# EAGLE schematic PCB 1b (EAGLE 9.0.1)
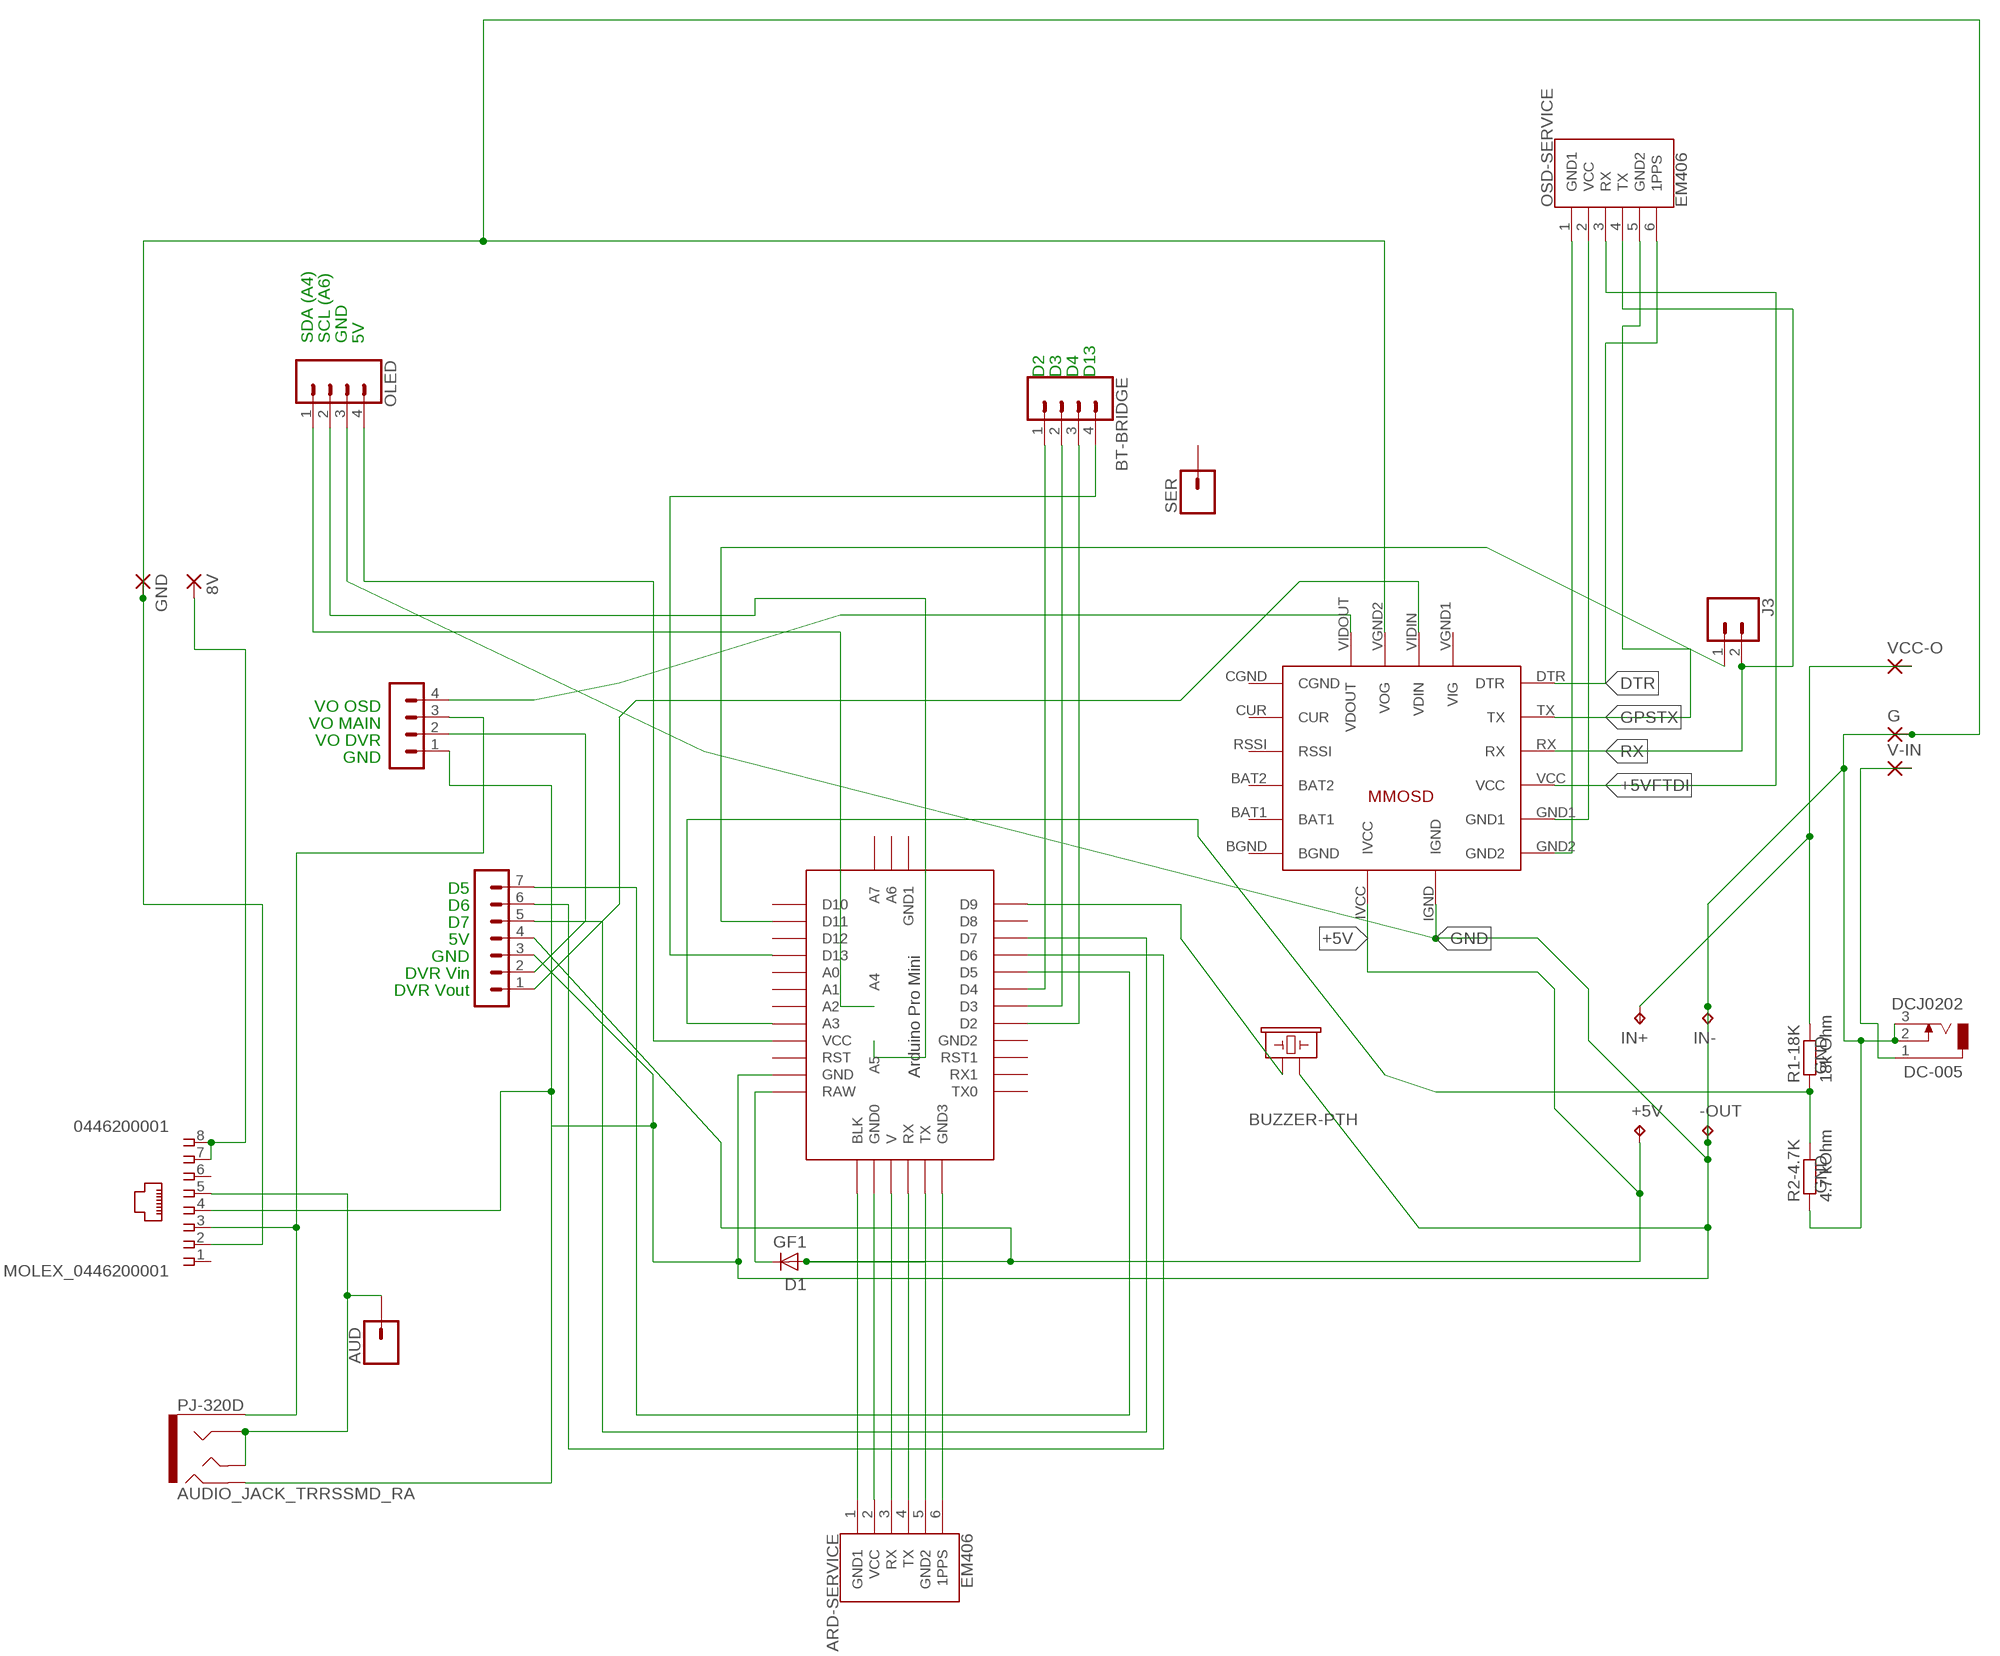
[diagram p0: schematic, sheet 1]

## Parts
8V  2,54/1,1  [2,54/1,1]
+5V  TPTP20SQ  [TP20SQ]
-OUT  TPTP20SQ  [TP20SQ]
ARD-SERVICE  EM406  [1X06-1MM]
AUD  CONN_01  [1X01]
BT-BRIDGE  CONN_04  [1X04]
BUZZ  BUZZER-PTH  [BUZZER-12MM]
D1  GF1  [SMA-DO214AC]
DC-005  DCJ0202  [DCJ0202]
DVR/MODULE-IO  MA07-1  [MA07-1]
G  2,54/1,1  [2,54/1,1]
GND  2,54/1,1  [2,54/1,1]
IN+  TPTP20SQ  [TP20SQ]
IN-  TPTP20SQ  [TP20SQ]
J3  CONN_02  [1X02]
MINIMOSD  MICROMINIMOSDPWR  [MMOSDNVDVID]
MOLEX_0446200001  0446200001  [0446200001]
OLED  CONN_04  [1X04]
OSD-SERVICE  EM406  [1X06-1MM]
PJ-320D  AUDIO_JACK_TRRSSMD_RA  [AUDIO_JACK_3.5MM_TRRS_SMD_RA]
R1-18K  18k Ohm  R-EU_M1206  [M1206]
R2-4.7K  4.7 kOhm  R-EU_M1206  [M1206]
SER  CONN_01  [1X01]
U$1  ABK-PRO-MINI  [ABK-PRO-MINI]
V-IN  2,54/1,1  [2,54/1,1]
V-IO  MA04-1  [MA04-1]
VCC-O  2,54/1,1  [2,54/1,1]

## Nets
8V: 8V.1(P) MOLEX_0446200001.7 MOLEX_0446200001.8
+: DC-005.1 V-IN.1(P)
+5V: +5V.TP D1.A DVR/MODULE-IO.4 MINIMOSD.IVCC
+5VFTDI [thin]: MINIMOSD.VCC OSD-SERVICE.3(RX)
AUDIO [medium]: AUD.1 MOLEX_0446200001.5 PJ-320D.RING1 PJ-320D.TIP
D5 [thin]: DVR/MODULE-IO.7 U$1.D5
D6 [thin]: DVR/MODULE-IO.6 U$1.D6
D7 [thin]: DVR/MODULE-IO.5 U$1.D7
D10RX [thin]: J3.1 U$1.D11
DTR [thin]: MINIMOSD.DTR OSD-SERVICE.6(1PPS)
DVRVIDEO-IN [medium]: DVR/MODULE-IO.2 V-IO.2
GND [d_cl]: -OUT.TP BUZZ.- DC-005.2 DC-005.3 DVR/MODULE-IO.3 G.1(P) GND.1(P) IN-.TP MINIMOSD.IGND MINIMOSD.VGND2(VOG) MOLEX_0446200001.2 MOLEX_0446200001.4 OLED.3 PJ-320D.RING2 R2-4.7K.1 U$1.GND V-IO.1
GPSTX [thin]: MINIMOSD.TX OSD-SERVICE.5(GND2)
HP5 [thin]: BT-BRIDGE.3 U$1.D2
HP6 [thin]: BT-BRIDGE.1 U$1.D4
N$1 [thin]: BT-BRIDGE.2 U$1.D3
N$2: OLED.4 U$1.VCC
N$3 [d_cl]: MINIMOSD.GND1 OSD-SERVICE.2(VCC)
N$4: D1.K(C) U$1.RAW
N$5: MINIMOSD.GND2 OSD-SERVICE.1(GND1)
N$7 [thin]: BT-BRIDGE.4 U$1.D13
N$10 [thin]: BUZZ.+ U$1.D9
N$12: R1-18K.1 R2-4.7K.2 U$1.A0(A3)
N$16 [thin]: ARD-SERVICE.1(GND1) U$1.BLK
N$18 [thin]: ARD-SERVICE.2(VCC) U$1.G(GND0)
N$19 [thin]: ARD-SERVICE.3(RX) U$1.5V(V)
N$21 [thin]: ARD-SERVICE.5(GND2) U$1.TX01(TX)
N$22 [thin]: ARD-SERVICE.6(1PPS) U$1.DTR(GND3)
OSDSIGNAL [medium]: MINIMOSD.VIDOUT(VDOUT) V-IO.4
RAWVIDEO_MODULE [medium]: DVR/MODULE-IO.1 MINIMOSD.VIDIN(VDIN)
RX [thin]: J3.2 MINIMOSD.RX OSD-SERVICE.4(TX)
SCL [thin]: OLED.2 U$1.A5
SDA [thin]: OLED.1 U$1.A4
V [thin]: ARD-SERVICE.4(TX) U$1.RX01(RX)
VCC: IN+.TP R1-18K.2 VCC-O.1(P)
VMAIN [medium]: MOLEX_0446200001.3 PJ-320D.EARTH V-IO.3
Unconnected: MINIMOSD.CUR MINIMOSD.RSSI MINIMOSD.VGND1(VIG) MOLEX_0446200001.1 MOLEX_0446200001.6 SER.1 U$1.A1(A2) U$1.A2(A1) U$1.A3(A0) U$1.A6 U$1.A7 U$1.D8 U$1.D10 U$1.D12 U$1.GND1(GND2) U$1.GND4(GND1) U$1.RST U$1.RST1 U$1.RX1 U$1.TX0

## Notes on the sheet
- SDA (A4) | SCL (A6) | GND | 5V
- D2 | D3 | D4 | D13
- VO OSD
- VO MAIN
- VO DVR
- GND
- D5
- D6
- D7
- 5V
- GND
- DVR Vin
- DVR Vout

## Power pins joined to a net without a drawn wire
BAT1: MINIMOSD.BAT1
BAT2: MINIMOSD.BAT2
BGND: MINIMOSD.BGND
CGND: MINIMOSD.CGND

## Library data of the parts
8V G GND V-IN VCC-O = wirepad:2,54/1,1: THROUGH-HOLE PAD
+5V -OUT IN+ IN- = testpad:TP: Test pad
ARD-SERVICE OSD-SERVICE = SparkFun-Connectors:EM406: EM406 GPS Connector Here is a six pin vertical 1.0mm pitch connector. It is useful if you need something very tiny as a connection. These are not the standard JST type connectors we use on most of our boards, but are actually the much smaller JST-SH type. Here is the connector we sell at SparkFun: JST SH Vertical 6-Pin Connector - SMD <https://www.sparkfun.com/products/579> (GPS-00579) Datasheet <http://www.sparkfun.com/datasheets/GPS/EM406-SMDConnector-eSH.pdf> It was used on these SparkFun products: SparkFun GPS Breakout <https://www.sparkfun.com/products/11818> (BOB-11818) SparkFun Weather Shield <https://www.sparkfun.com/products/12081> (DEV-12081) And many, many other GPS related products.; PROD_ID: CONN-08249; SF_ID: GPS-00579
AUD SER = SparkFun-Connectors:CONN_01: Single connection point. Often used as Generic Header-pin footprint for 0.1 inch spaced/style header connections On any of the 0.1 inch spaced packages, you can populate with these: Break Away Headers - Straight <https://www.sparkfun.com/products/116> (PRT-00116) Break Away Male Headers - Right Angle <https://www.sparkfun.com/products/553> (PRT-00553) Female Headers <https://www.sparkfun.com/products/115> (PRT-00115) Break Away Headers - Machine Pin <https://www.sparkfun.com/products/117> (PRT-00117) Break Away Female Headers - Swiss Machine Pin <https://www.sparkfun.com/products/743> (PRT-00743) This device is also useful as a general connection point to wire up your design to another part of your project. Our various solder wires solder well into these plated through hole pads. Hook-Up Wire - Assortment (Stranded, 22 AWG) <https://www.sparkfun.com/products/11375> (PRT-11375) Hook-Up Wire - Assortment (Solid Core, 22 AWG) <https://www.sparkfun.com/products/11367> (PRT-11367) View the entire wire category on our website here <https://www.sparkfun.com/categories/141> Special notes: SMTSO-256-ET is a "flush mount" nut for a 4-40 screw. We mostly use this on specialty testbeds; it is a nice way to connect hardware to your PCB at an adjustable hieght. Also note, the SNAP packages are for using a snappable style connector. We sell a baggie of snaps and they are also used on two LilyPad designs: Snap Assortment - 30 pack (male and female) <https://www.sparkfun.com/products/11347> (DEV-11347) LilyPad Arduino SimpleSnap <https://www.sparkfun.com/products/10941> (DEV-10941) LilyPad SimpleSnap Protoboard <https://www.sparkfun.com/products/10940> (DEV-10940)
BT-BRIDGE OLED = SparkFun-Connectors:CONN_04: Multi connection point. Often used as Generic Header-pin footprint for 0.1 inch spaced/style header connections On any of the 0.1 inch spaced packages, you can populate with these: Break Away Headers - Straight <https://www.sparkfun.com/products/116> (PRT-00116) Break Away Male Headers - Right Angle <https://www.sparkfun.com/products/553> (PRT-00553) Female Headers <https://www.sparkfun.com/products/115> (PRT-00115) Break Away Headers - Machine Pin <https://www.sparkfun.com/products/117> (PRT-00117) Break Away Female Headers - Swiss Machine Pin <https://www.sparkfun.com/products/743> (PRT-00743) For SCREWTERMINALS and SPRING TERMINALS visit here: Screw Terimnals on SparkFun.com <https://www.sparkfun.com/search/results?term=Screw+Terminals> (5mm/3.5mm/2.54mm spacing) This device is also useful as a general connection point to wire up your design to another part of your project. Our various solder wires solder well into these plated through hole pads. Hook-Up Wire - Assortment (Stranded, 22 AWG) <https://www.sparkfun.com/products/11375> (PRT-11375) Hook-Up Wire - Assortment (Solid Core, 22 AWG) <https://www.sparkfun.com/products/11367> (PRT-11367) View the entire wire category on our website here <https://www.sparkfun.com/categories/141> Special notes: Molex polarized connector foot print use with SKU : PRT-08231 with associated crimp pins and housings. 1MM SMD Version SKU: PRT-10208; PROD_ID: CONN-09696
BUZZ = SparkFun-Electromechanical:BUZZER: Buzzer Small round buzzers that operate around the audible 2kHz range. You can use these as speakers to create simple music or user interfaces. Variant Overview: PTH - Mini Speaker - PC Mount 12mm 2.048kHz <https://www.sparkfun.com/products/7950> PTH_KIT - Mini Speaker - PC Mount 12mm 2.048kHz <https://www.sparkfun.com/products/7950> KIT simplifies soldering by adding stop mask to one side of the pads. PTH_NO_SILK - Mini Speaker - PC Mount 12mm 2.048kHz <https://www.sparkfun.com/products/7950> No silkscreen indicator of buzzer outline. PTH_KIT_NO_SILK - Mini Speaker - PC Mount 12mm 2.048kHz <https://www.sparkfun.com/products/7950> KIT package w/o silkscreen SMD - Buzzer Audio Magnetic (CCV-084B16) SMD buzzer used on, e.g. the LilyPad Buzzer <https://www.sparkfun.com/products/8463> and RFID USB Reader <https://www.sparkfun.com/products/9963>. SMD_KIT - Buzzer Audio Magnetic (CCV-084B16) SMD Buzzer with elongated pins to make soldering easier. Used on the SparkFun Simon Says - Surface Mount Soldering Kit <https://www.sparkfun.com/products/10935>.; PROD_ID: COMP-08253; SF_SKU: COM-07950; SPICEPREFIX: X
D1 = diode:GF1: DIODE
DC-005 = con-jack:DCJ0202: DC POWER JACK Source: DCJ0202.pdf; OC_FARNELL: unknown; OC_NEWARK: unknown
DVR/MODULE-IO = con-lstb:MA07-1: PIN HEADER; OC_FARNELL: unknown; OC_NEWARK: unknown
J3 = SparkFun-Connectors:CONN_02: Multi connection point. Often used as Generic Header-pin footprint for 0.1 inch spaced/style header connections On any of the 0.1 inch spaced packages, you can populate with these: Break Away Headers - Straight <https://www.sparkfun.com/products/116> (PRT-00116) Break Away Male Headers - Right Angle <https://www.sparkfun.com/products/553> (PRT-00553) Female Headers <https://www.sparkfun.com/products/115> (PRT-00115) Break Away Headers - Machine Pin <https://www.sparkfun.com/products/117> (PRT-00117) Break Away Female Headers - Swiss Machine Pin <https://www.sparkfun.com/products/743> (PRT-00743) For SCREWTERMINALS and SPRING TERMINALS visit here: Screw Terimnals on SparkFun.com <https://www.sparkfun.com/search/results?term=Screw+Terminals> (5mm/3.5mm/2.54mm spacing) This device is also useful as a general connection point to wire up your design to another part of your project. Our various solder wires solder well into these plated through hole pads. Hook-Up Wire - Assortment (Stranded, 22 AWG) <https://www.sparkfun.com/products/11375> (PRT-11375) Hook-Up Wire - Assortment (Solid Core, 22 AWG) <https://www.sparkfun.com/products/11367> (PRT-11367) View the entire wire category on our website here <https://www.sparkfun.com/categories/141> Special notes: Molex polarized connector foot print use with: PRT-08233 with associated crimp pins and housings. 2.54_SCREWTERM for use with PRT-10571. 3.5mm Screw Terminal footprints for PRT-08084 5mm Screw Terminal footprints for use with PRT-08432
MINIMOSD = FPVTools:MICROMINIMOSDPWR
MOLEX_0446200001 = con-molex:0446200001: RJ-45 INVERTED MODULAR JACK ASSEMBLY WITH RJ-11 KEEPOUT FEATURE Source: Data sheet <http://www.farnell.com/datasheets/73207.pdf>; MF: MOLEX; OC_FARNELL: unknown
PJ-320D = SparkFun-Connectors:AUDIO_JACK_TRRS: Audio Jack - 3.5mm TRRS (SMD) This is a 3.5mm TRRS SMD audio jack. TRRS connectors are the audio-style connectors that you see on some phones, MP3 players and development boards. TRRS stands for “tip, ring, ring, sleeve,” which reflects that this has three conductors and a ground. SparkFun Products: Audio Jack <https://www.sparkfun.com/products/12639> mbed Starter Kit <https://www.sparkfun.com/products/12968> SparkFun TRRS 3.5mm Jack Breakout <https://www.sparkfun.com/products/11570>; PROD_ID: CONN-10676; SF_ID: PRT-12639
R1-18K R2-4.7K = rcl:R-EU_: RESISTOR, European symbol; SPICEPREFIX: R
U$1 = Arduino-clone:ABK-PRO-MINI: ABK Pro-Mini Arduino Clone
V-IO = con-lstb:MA04-1: PIN HEADER; OC_FARNELL: unknown; OC_NEWARK: unknown

## Net classes
0 default: width 0.762 mm, drill 0.508 mm, clearance 0.508 mm
1 thin: width 0.4 mm, drill 0.3 mm, clearance 0.3 mm
2 medium: width 0.5 mm, drill 0.4 mm, clearance 0.3 mm
3 d_cl: width 0.762 mm, drill 0.508 mm, clearance 0.3 mm